# Altium schematic sheet CENTRALLEDS.SchDoc: LEDBO - LTSN-N213EGBW (BATMON)
size B; Author: Sébastien Gélinas; Organization: SmartHalo; Address1: 5445 de Gaspé; Address2: Montréal, QC; Address3: Canada; Address4: H2T 3B2; Revision: 1; SheetNumber: 2; SheetTotal: 3
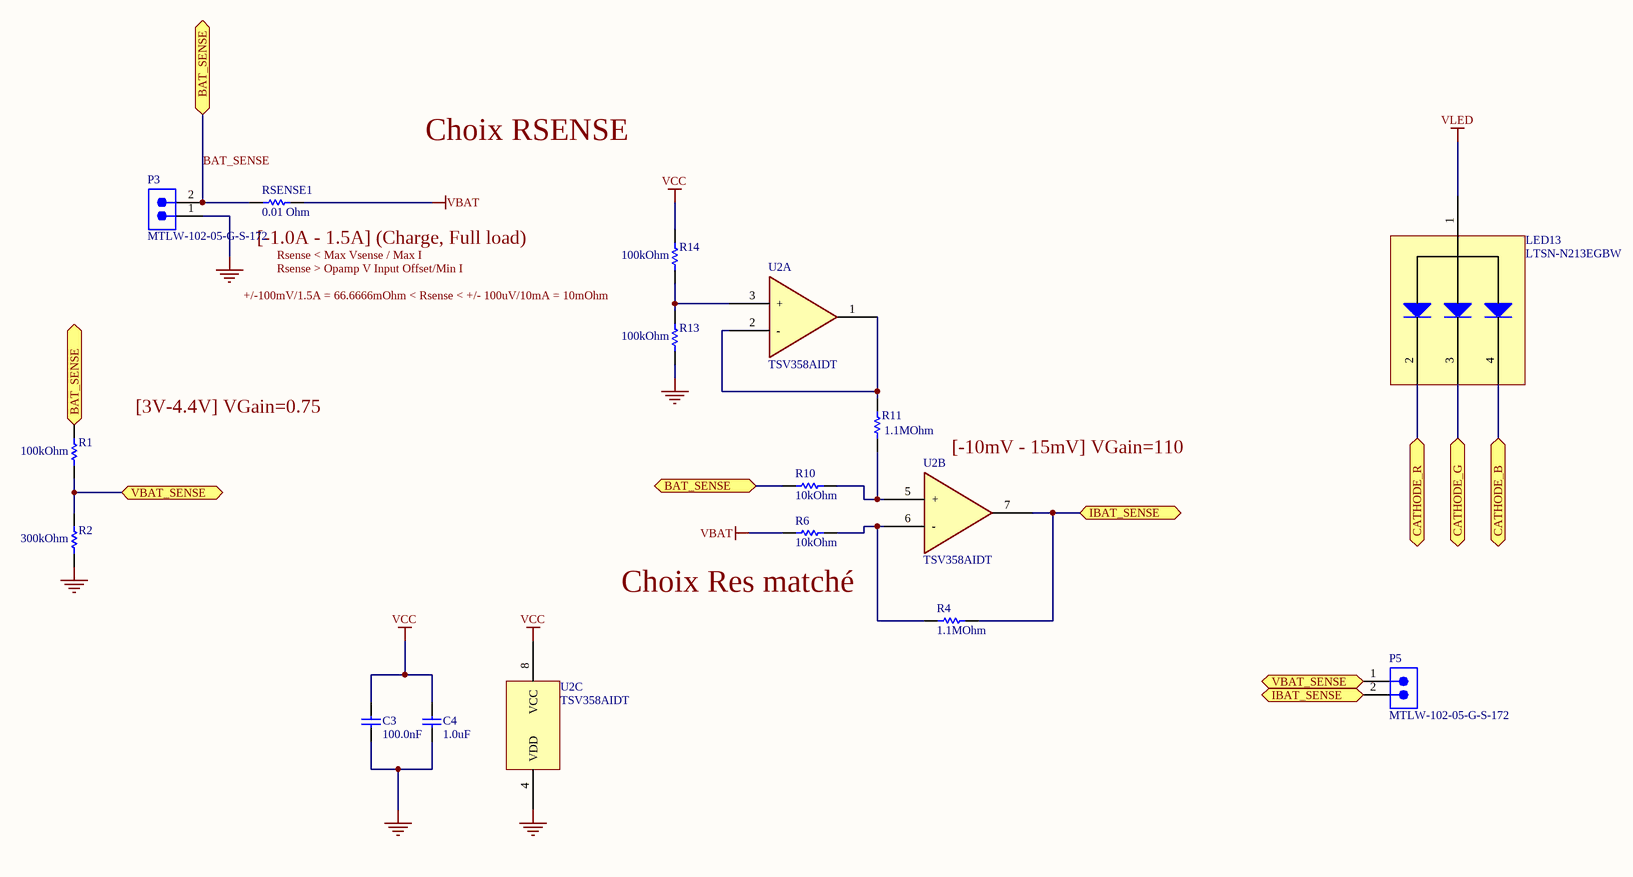
[diagram p0: CENTRALLEDS.SchDoc]

## Parts
C3  100.0nF  [CAPC0603(1608)100_N]
C4  1.0uF  [CAPC0603(1608)100_N]
LED13  LTSN-N213EGBW  [LTSN-N213EGBW]
P3  MTLW-102-05-G-S-172  [SMTC-MTLW-102-05-X-S-172]  (no BOM)
P5  MTLW-102-05-G-S-172  [SMTC-MTLW-102-05-X-S-172]  (no BOM)
R1  100kOhm  [RESC0603(1608)_M]
R2  300kOhm  [RESC0603(1608)_M]
R4  1.1MOhm  [RESC0603(1608)_M]
R6  10kOhm  [RESC0603(1608)_M]
R10  10kOhm  [RESC0603(1608)_M]
R11  1.1MOhm  [RESC0603(1608)_M]
R13  100kOhm  [RESC0603(1608)_M]
R14  100kOhm  [RESC0603(1608)_M]
RSENSE1  0.01 Ohm  [RESC1206(3216)_N]
U2  TSV358AIDT  [SOP8 - ST]  (parts A,B,C of 3)

## Ports
BAT_SENSE, CATHODE_B, CATHODE_G, CATHODE_R, IBAT_SENSE, VBAT_SENSE

## Nets
GND: C3.2 C4.2 P3.1 R2.1 R13.1 U2.4(VDD)
VBAT: R6.2 RSENSE1.1
VCC: C3.1 C4.1 R14.2 U2.8(VCC)
VLED: LED13.1(Anode)
BAT_SENSE: P3.2 R1.2 R10.2 RSENSE1.2 ; port BAT_SENSE
CATHODE_B: LED13.4(Cathode_Blue) ; port CATHODE_B
CATHODE_G: LED13.3(Cathode_Green) ; port CATHODE_G
CATHODE_R: LED13.2(Cathode_Red) ; port CATHODE_R
IBAT_SENSE: P5.2 R4.1 U2.7(OUT2) ; port IBAT_SENSE
VBAT_SENSE: P5.1 R1.1 R2.2 ; port VBAT_SENSE
NetR4_2: R4.2 R6.1 U2.6(-)
NetR10_1: R10.1 R11.1 U2.5(+)
NetR11_2: R11.2 U2.1(OUT1) U2.2(-)
NetR13_2: R13.2 R14.1 U2.3(+)

## Notes on the sheet
- Choix RSENSE
- +/-100mV/1.5A = 66.6666mOhm < Rsense < +/- 100uV/10mA = 10mOhm
- (near RSENSE1) [-1.0A - 1.5A] (Charge, Full load)
- (near RSENSE1) Rsense < Max Vsense / Max I
- Rsense > Opamp V Input Offset/Min I
- [3V-4.4V] VGain=0.75
- (near U2) [-10mV - 15mV] VGain=110
- (near R6) Choix Res matché
- Title
- Size:
- Date:
- B
- Author:
- Time:
- Sheet
- Revision:
- of
- File:

## Library data of the parts
C3 C4 = CAP0603: Chip Cap 0603 X7R 10%; Part Number: C0402-1n0; Note: Chip Cap X7R 10%; Artikkelnr Noca: 20039223; Published: 2009-05-08; LatestRevisionDate: 2009-11-23; Publisher: Nordic Semiconductor; Manufacturer: *; Manufacturer Part Number: *; Datasheet: *; Footprint: 0603; Pin Count: 2; Supplier: *
  C3: Value: 100.0nF
  C4: Value: 1.0uF
LED13 = LTSN-N213EGBW: LED SMD LTSN-N213EGBW; Manufacturer: LiteOn
P3 P5 = SMTC-MTLW-102-05-X-S-172: Low Profile .025" SQ Post Header, Through-hole, Vertical, -55 to 125 degC, 2.54 mm Pitch, 2-Pin, Male, RoHS; Manufacturer: Samtec; Pitch: 2.54 mm; ComponentLink2URL: http://www.samtec.com/documents/webfiles/pdf/MTLW_TH.PDF; PackageDescription: Low Profile Terminal Assembly; ComponentLink3URL: http://www.samtec.com/documents/webfiles/cpdf/MTLW-1XX-XX-XX-X-XXX-XX-XX-MKT1.pdf; PackageReference: MTLW-102-05-X-S-172; Mounting Technology: Through-hole; ComponentLink2Description: Datasheet; PackageVersion: T, 6/1991; Orientation: Vertical; DatasheetVersion: F-214; RoHS: True; ComponentLink3Description: Package Specification; ComponentLink1URL: http://www.samtec.com; Temperature Range: -55 to 125 degC; PartNumber: MTLW-102-05-G-S-172; ComponentLink1Description: Manufacturer URL
R1 R13 R14 = CMP-1012-00090-1: 100K 0.063W 1%  0603 (1608 Metric)  SMD; Case-Metric: 1608; Case-EIA: 0603; Tolerance: 1 %; Technology: SMT; Power: 0.063 W; Value: 100kOhm
R2 = CMP-1012-00090-1: 300K 0.063W 1% 0603 (1608 Metric)  SMD; Case-Metric: 1608; Case-EIA: 0603; Tolerance: 1 %; Technology: SMT; Power: 0.063 W; Value: 300kOhm
R4 R11 = CMP-1012-00090-1: 1M1 1/16W 1% 0603 (1608 Metric)  SMD; Case-Metric: 1608; Power: 0.063 W; Case-EIA: 0603; Tolerance: 1 %; Technology: SMT; Value: 1.1MOhm
R6 R10 = CMP-1012-00090-1: 10K 1/16W 1% 0603 (1608 Metric)  SMD; Case-Metric: 1608; Power: 0.063W; Case-EIA: 0603; Tolerance: 1 %; Technology: SMT; Value: 10kOhm
RSENSE1 = RES1206(3216)_N: 0R01 0.25 W 1%  1206 (3216 Metric)  SMD; Case-Metric: 3216; Power: 0.25 W; Case-EIA: 1206; Tolerance: 1%; Technology: SMT; Value: 0.01 Ohm
U2 = TSV358AIDT: IC OPAMP GP 1.4MHZ RRO 8SO